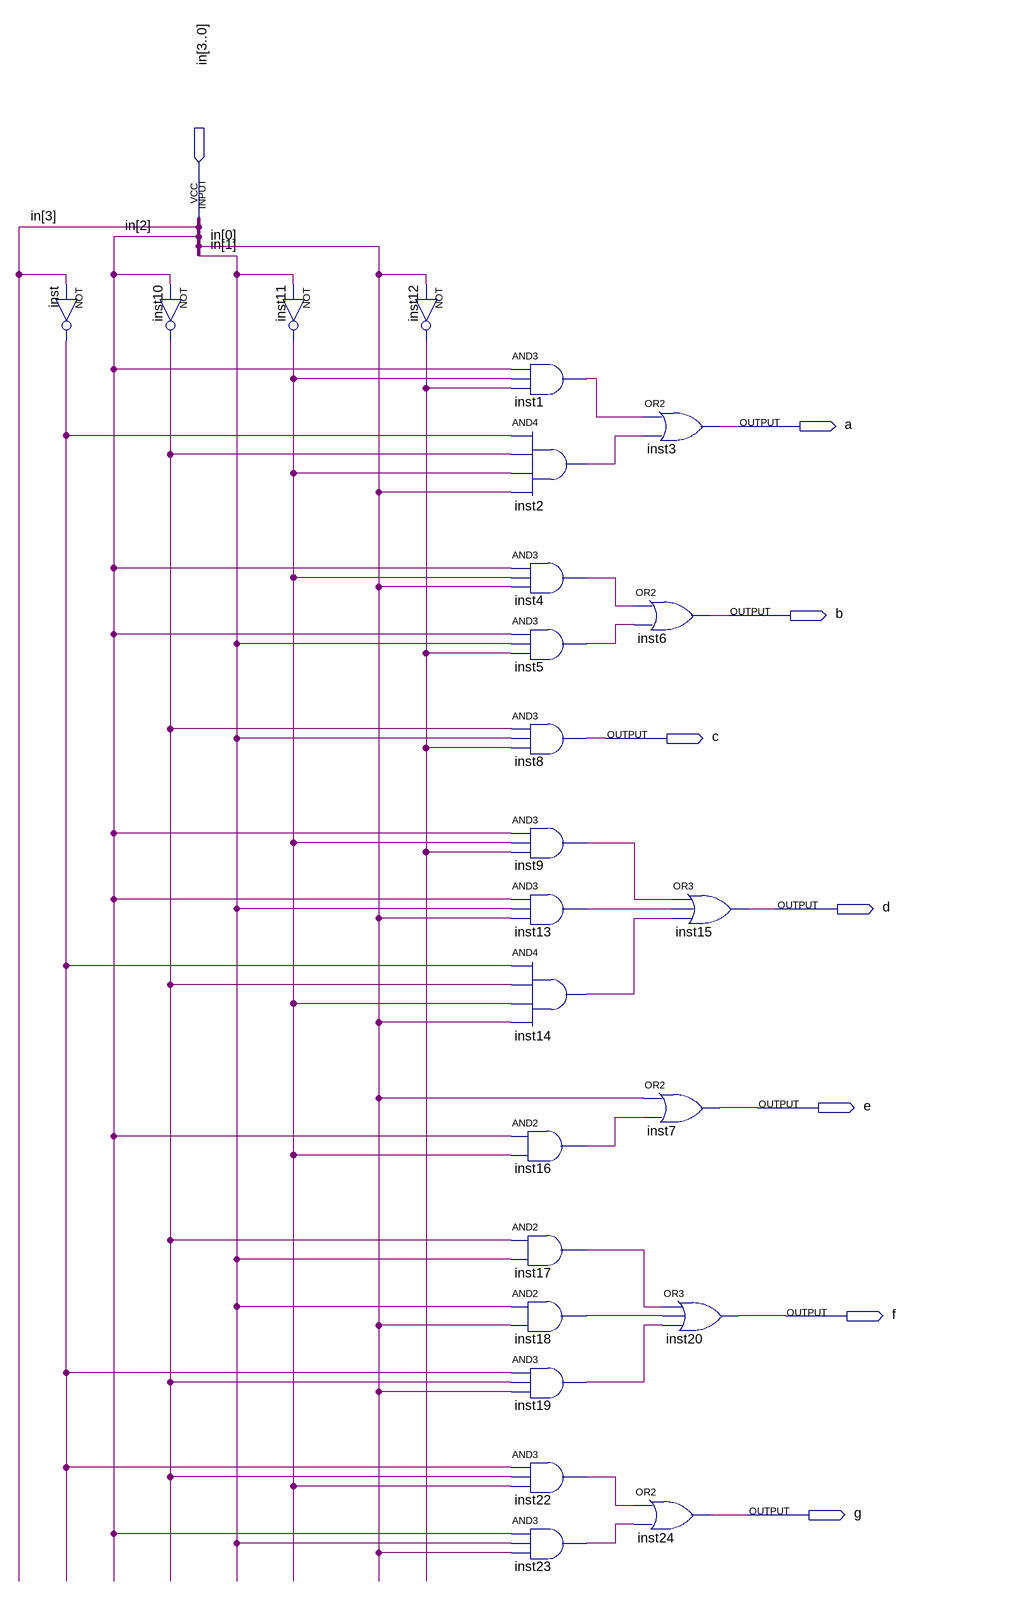
[diagram p0: schematic sheet]
// Quartus schematic BCDSegments.bdf as structural Verilog: 24 symbols, 8 pins
module BCDSegments (
  input  [3:0] in,
  output a,
  output b,
  output c,
  output d,
  output e,
  output f,
  output g
);

  wire inst1_out, inst2_out, inst4_out, inst5_out, inst9_out, inst10_out, inst11_out, inst12_out, inst13_out,
       inst14_out, inst16_out, inst17_out, inst18_out, inst19_out, inst22_out, inst23_out, inst_out;

  not inst (inst_out, in[3]);
  not inst10 (inst10_out, in[2]);
  not inst11 (inst11_out, in[1]);
  not inst12 (inst12_out, in[0]);
  and inst1 (inst1_out, in[2], inst11_out, inst12_out);
  and inst2 (inst2_out, inst_out, inst10_out, inst11_out, in[0]);
  and inst4 (inst4_out, in[2], inst11_out, in[0]);
  and inst5 (inst5_out, in[2], in[1], inst12_out);
  and inst8 (c, inst10_out, in[1], inst12_out);
  and inst9 (inst9_out, in[2], inst11_out, inst12_out);
  and inst13 (inst13_out, in[2], in[1], in[0]);
  and inst14 (inst14_out, inst_out, inst10_out, inst11_out, in[0]);
  and inst16 (inst16_out, in[2], inst11_out);
  and inst17 (inst17_out, inst10_out, in[1]);
  and inst18 (inst18_out, in[1], in[0]);
  and inst19 (inst19_out, inst_out, inst10_out, in[0]);
  and inst22 (inst22_out, inst_out, inst10_out, inst11_out);
  and inst23 (inst23_out, in[2], in[1], in[0]);
  or inst3 (a, inst1_out, inst2_out);
  or inst6 (b, inst4_out, inst5_out);
  or inst15 (d, inst9_out, inst13_out, inst14_out);
  or inst7 (e, in[0], inst16_out);
  or inst20 (f, inst17_out, inst18_out, inst19_out);
  or inst24 (g, inst22_out, inst23_out);
endmodule
